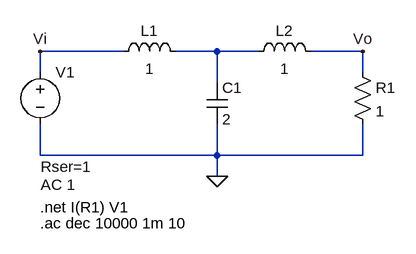
[diagram p0: schematic Circuito.asc]
Circuito.asc, the LTspice schematic file:
Version 4
SHEET 1 880 680
WIRE 96 144 -32 144
WIRE 240 144 176 144
WIRE 304 144 240 144
WIRE 464 144 384 144
WIRE -32 176 -32 144
WIRE 464 176 464 144
WIRE 240 192 240 144
WIRE -32 304 -32 256
WIRE 240 304 240 256
WIRE 240 304 -32 304
WIRE 464 304 464 256
WIRE 464 304 240 304
WIRE 240 336 240 304
FLAG 464 144 Vo
FLAG -32 144 Vi
FLAG 240 336 0
SYMBOL ind 80 160 R270
WINDOW 0 32 56 VTop 2
WINDOW 3 5 56 VBottom 2
SYMATTR InstName L1
SYMATTR Value 1
SYMBOL ind 288 160 R270
WINDOW 0 32 56 VTop 2
WINDOW 3 5 56 VBottom 2
SYMATTR InstName L2
SYMATTR Value 1
SYMBOL cap 224 192 R0
SYMATTR InstName C1
SYMATTR Value 2
SYMBOL res 448 160 R0
SYMATTR InstName R1
SYMATTR Value 1
SYMBOL voltage -32 160 R0
WINDOW 123 1 189 Left 2
WINDOW 39 1 161 Left 2
SYMATTR Value2 AC 1
SYMATTR SpiceLine Rser=1
SYMATTR InstName V1
SYMATTR Value ""
TEXT -32 384 Left 2 !.net I(R1) V1
TEXT -32 408 Left 2 !.ac dec 10000 1m 10

The netlist it stands for:
* Circuito.asc
L1 Vi N001 1
L2 N001 Vo 1
C1 N001 0 2
R1 Vo 0 1
V1 Vi 0 AC 1 Rser=1
.net I(R1) V1
.ac dec 10000 1m 10
.backanno
.end